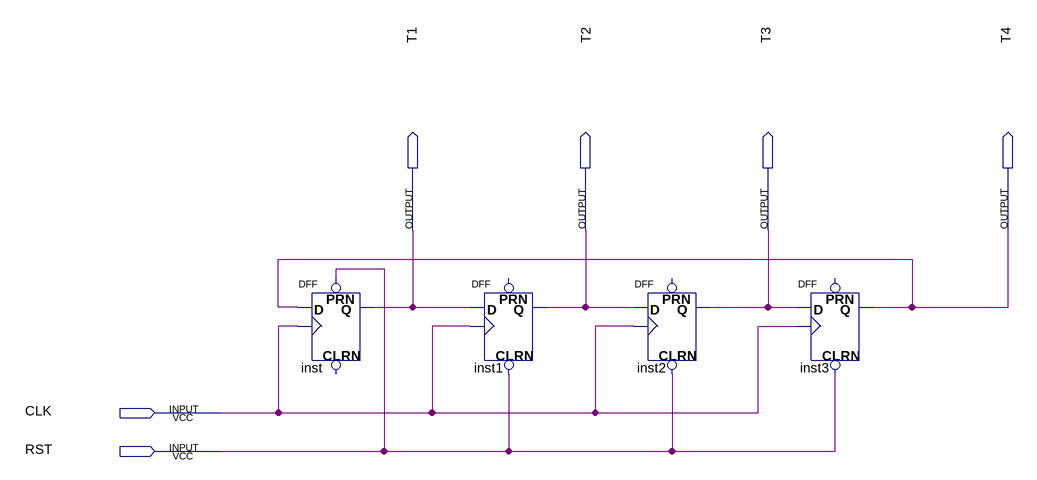
[diagram p0: schematic sheet]
// Quartus schematic exp11-1.bdf as structural Verilog: 4 symbols, 6 pins
module \exp11-1  (
  input  CLK,
  input  RST,
  output T1,
  output T2,
  output T3,
  output T4
);

  DFF inst (.CLK(CLK), .D(T4), .PRN(RST), .Q(T1));  // open: CLRN
  DFF inst1 (.CLRN(RST), .CLK(CLK), .D(T1), .Q(T2));  // open: PRN
  DFF inst2 (.CLRN(RST), .CLK(CLK), .D(T2), .Q(T3));  // open: PRN
  DFF inst3 (.CLRN(RST), .CLK(CLK), .D(T3), .Q(T4));  // open: PRN
endmodule
